# Altium project Mergen SMPS Board.PrjPcb
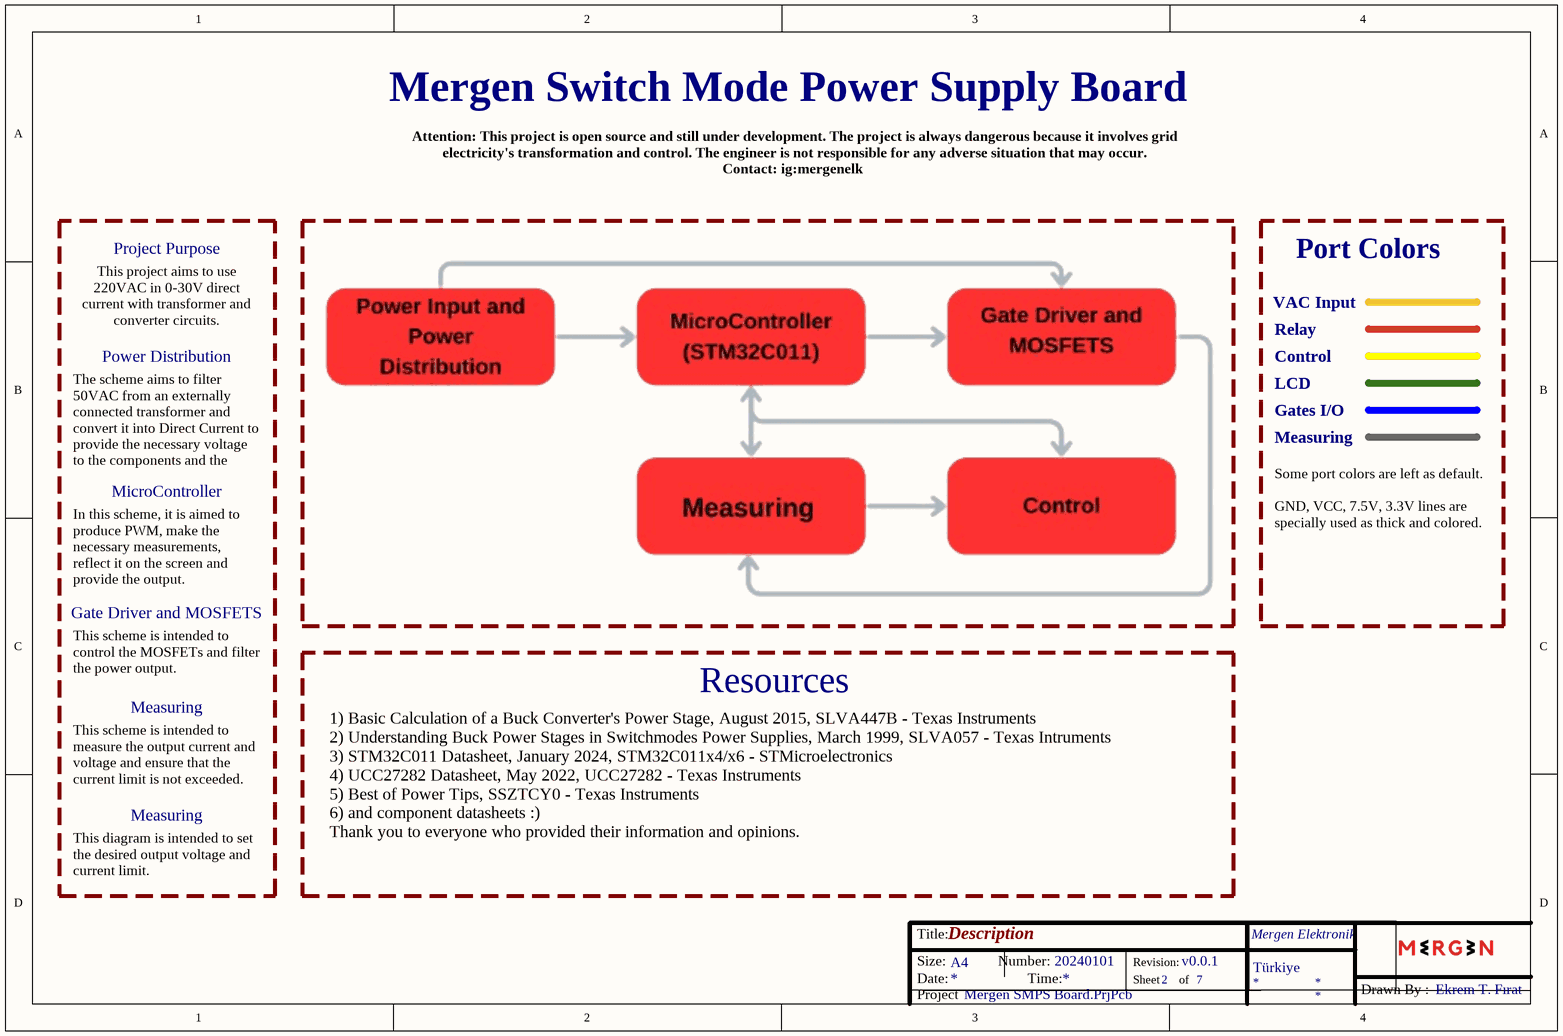
[diagram p0: Description.SchDoc]
6 sheets, 82 parts. Net scope: flat (ports and power ports of the same name join across sheets).
Sheets:
  Description.SchDoc
  PowerDistribution.SchDoc
  MicroController.SchDoc
  GateDriverandMosfets.SchDoc
  Measuring.SchDoc
  Control.SchDoc

## Sheet Description.SchDoc: Description
size A4; ApprovedBy: Ekrem Turan Fırat; CheckedBy: Ekrem Turan Fırat; Author: Ekrem Turan Fırat; CompanyName: Mergen Elektronik; DrawnBy: Ekrem T. Fırat; Engineer: Ekrem Turan Fırat; Organization: Mergen Elektronik; Address1: Türkiye; DocumentNumber: 20240101; Revision: v0.0.1; SheetNumber: 2; SheetTotal: 7

### Notes on the sheet
- Mergen Switch Mode Power Supply Board
- Attention: This project is open source and still under development. The project is always dangerous because it involves grid electricity's transformation and control. The engineer is not responsible for any adverse situation that may occur.
  Contact: ig:mergenelk
- Project Purpose
- Port Colors
- VAC Input
- This project aims to use 220VAC in 0-30V direct current with transformer and converter circuits.
- Power Distribution
- Relay
- Control
- LCD
- Gates I/O
- Measuring
- The scheme aims to filter 50VAC from an externally connected transformer and convert it into Direct Current to provide the necessary voltage to the components and the system.
- MicroController
- In this scheme, it is aimed to produce PWM, make the necessary measurements, reflect it on the screen and provide the output.
- Gate Driver and MOSFETS
- Some port colors are left as default.
  GND, VCC, 7.5V, 3.3V lines are specially used as thick and colored.
- This scheme is intended to control the MOSFETs and filter the power output.
- Resources
- This scheme is intended to measure the output current and voltage and ensure that the current limit is not exceeded.
- This diagram is intended to set the desired output voltage and current limit.
- 1) Basic Calculation of a Buck Converter's Power Stage, August 2015, SLVA447B - Texas Instruments
  2) Understanding Buck Power Stages in Switchmodes Power Supplies, March 1999, SLVA057 - Texas Intruments
  3) STM32C011 Datasheet, January 2024, STM32C011x4/x6 - STMicroelectronics
  4) UCC27282 Datasheet, May 2022, UCC27282 - Texas Instruments
  5) Best of Power Tips, SSZTCY0 - Texas Instruments
  6) and component datasheets :)
  Thank you to everyone who provided their information and opinions.
- Title:
- Size:
- Date:
- A4
- Number:
- Time:
- Revision:
- Sheet
- of
- Project
- Drawn By :

## Sheet PowerDistribution.SchDoc: Power Distribution
size A4; ApprovedBy: Ekrem Turan Fırat; CheckedBy: Ekrem Turan Fırat; Author: Ekrem Turan Fırat; CompanyName: Mergen Elektronik; DrawnBy: Ekrem T. Fırat; Engineer: Ekrem Turan Fırat; Organization: Mergen Elektronik; Address1: Türkiye; DocumentNumber: 20240101; Revision: v0.0.1; SheetNumber: 3; SheetTotal: 7
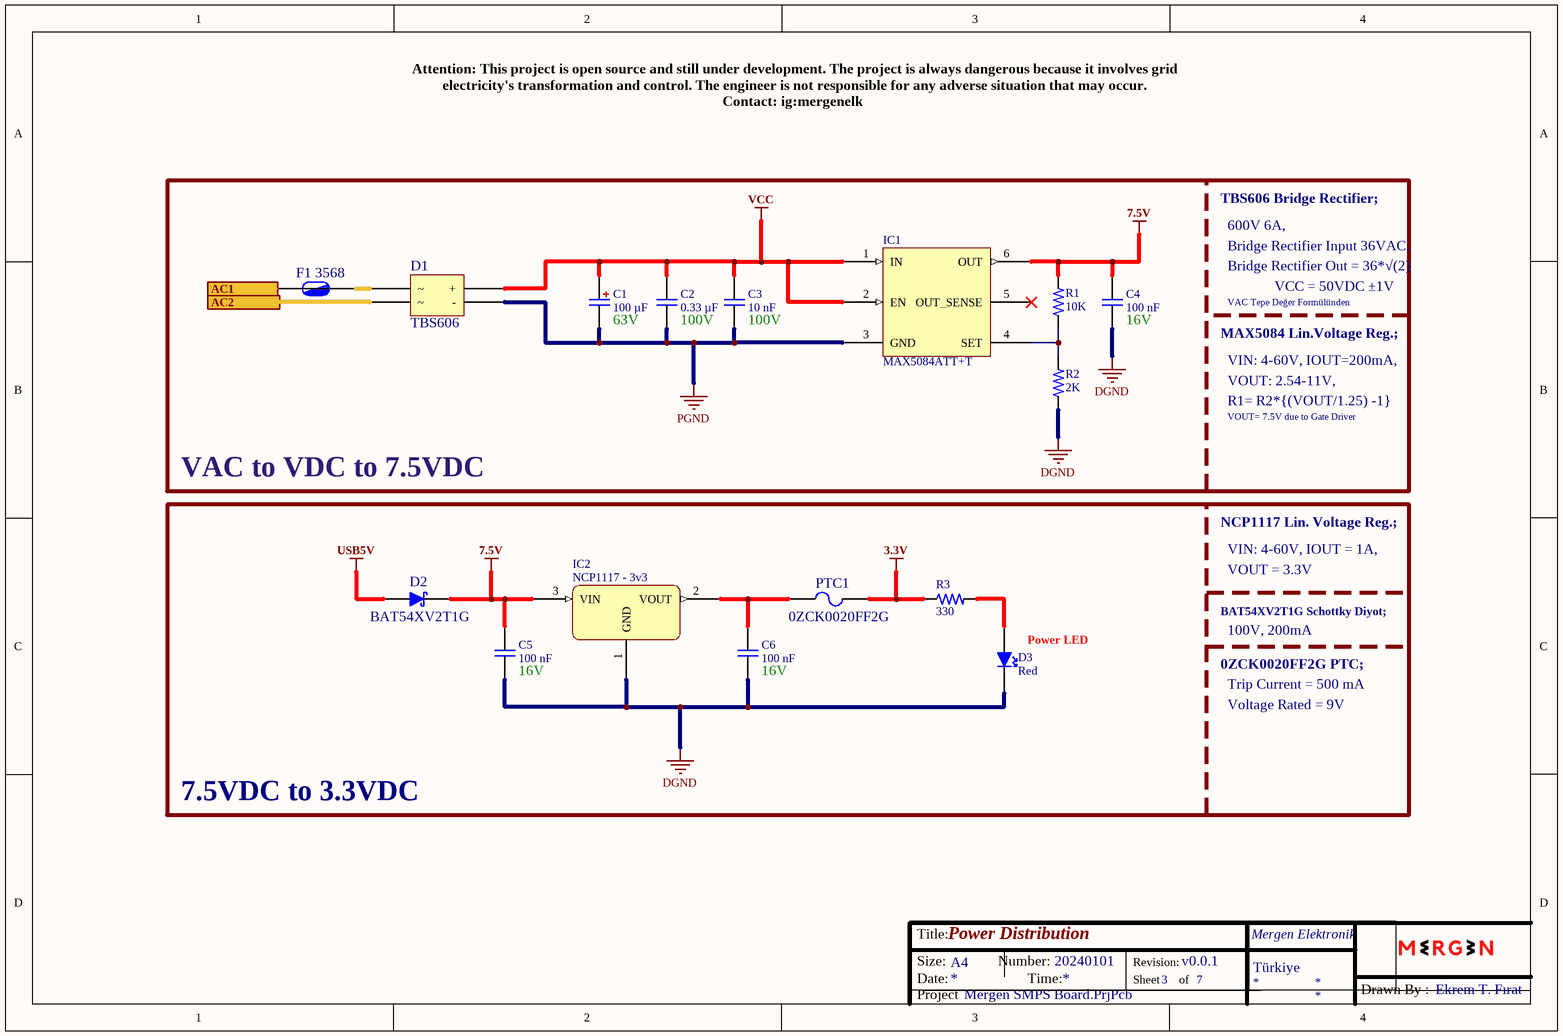
[diagram p1: PowerDistribution.SchDoc]

### Parts
C1  100 µF  Voltage Rated: 63V  [MergenElektronik_Capacitors_AluminumElectrolytics_SMDs_10x10.5mm]
C2  0.33 µF  Voltage Rated: 100V  [MergenElektronik_Capacitors_Ceramics_SMDs_1206_S_NS]
C3  10 nF  Voltage Rated: 100V  [MergenElektronik_Capacitors_Ceramics_SMDs_0603_S_NS]
C4  100 nF  Voltage Rated: 16V  [MergenElektronik_Capacitors_Ceramics_SMDs_0603_S_NS]
C5  100 nF  Voltage Rated: 16V  [MergenElektronik_Capacitors_Ceramics_SMDs_0603_S_NS]
C6  100 nF  Voltage Rated: 16V  [MergenElektronik_Capacitors_Ceramics_SMDs_0603_S_NS]
D1  TBS606  [MergenElektronik_Diodes_BridgeRectifiers_TBS606]
D2  BAT54XV2T1G  [MergenElektronik_Diodes_SchottkyDiodes_SOD-523]
D3  Red  [MergenElektronik_Leds_SMDs_0603_S_NS]
F1  3568  [MergenElektronik_FuseHolders_BladeType_3568]
IC1  MAX5084ATT+T  [MergenElektronik_Regulators_Linears_6-TDFN]
IC2  NCP1117 - 3v3  [MergenElektronik_Regulators_Linears_SOT223]
PTC1  0ZCK0020FF2G  [MergenElektronik_CircuitProtections_PTCs_0603_S_NS]
R1  10K  [MergenElektronik_Resistors_ChipResistors_0603_S_NS]
R2  2K  [MergenElektronik_Resistors_ChipResistors_0603_S_NS]
R3  330  [MergenElektronik_Resistors_ChipResistors_0603_S_NS]

### Blocks framed on the sheet
VAC to VDC to 7.5VDC: C1-C4 D1 F1 IC1 R1 R2
7.5VDC to 3.3VDC: C5 C6 D2 D3 IC2 PTC1 R3

### Ports
AC1 (in), AC2 (in)

### Nets
3.3V: PTC1.2 R3.1
7.5V: C4.1 C5.1 D2.2(KATOT) IC1.6(OUT) IC2.3(VIN) R1.2
DGND: C4.2 C5.2 C6.2 D3.2(KATOT) IC2.1(GND) R2.1
PGND: C1.1 C2.2 C3.2 D1.2(-) IC1.3(GND)
USB5V: D2.1(ANOT)
VCC: C1.2 C2.1 C3.1 D1.1(+) IC1.1(IN) IC1.2(EN)
NetC6_1: C6.1 IC2.2(VOUT) PTC1.1
NetD1_3: D1.3 F1.2
NetD1_4: D1.4 ; port AC2
NetD3_1: D3.1(ANOT) R3.2
NetIC1_4: IC1.4(SET) R1.1 R2.2

Not connected (* = marked no-connect by the designer): F1 1; IC1 5(OUT_SENSE)*

### Notes on the sheet
- Attention: This project is open source and still under development. The project is always dangerous because it involves grid electricity's transformation and control. The engineer is not responsible for any adverse situation that may occur.
  Contact: ig:mergenelk
- TBS606 Bridge Rectifier;
- 600V 6A,
- Bridge Rectifier Input 36VAC,
- Bridge Rectifier Out = 36*√(2)
- VAC Tepe Değer Formülünden
- VCC = 50VDC ±1V
- MAX5084 Lin.Voltage Reg.;
- VIN: 4-60V, IOUT=200mA,
- VOUT: 2.54-11V,
- R1= R2*{(VOUT/1.25) -1}
- VOUT= 7.5V due to Gate Driver
- NCP1117 Lin. Voltage Reg.;
- VIN: 4-60V, IOUT = 1A,
- VOUT = 3.3V
- (near D3) Power LED
- BAT54XV2T1G Schottky Diyot;
- 100V, 200mA
- 0ZCK0020FF2G PTC;
- Trip Current = 500 mA
- Voltage Rated = 9V
- Title:
- Size:
- Date:
- A4
- Number:
- Time:
- Revision:
- Sheet
- of
- Project
- Drawn By :

### Library data of the parts
C1 = MergenElektronik_Capacitors_AluminumElectrolytics_SMDs_UUX1J101MNL1GS: Mergen Elektronik - Capacitors - Aluminum Electrolytics - SMDs - UUX1J101MNL1GS; Manufacturer: Nichicon; Model: Aluminum Electrolytic Capacitors; Tolerance: ±20%; Value: 100 µF; Temperature: -55°C up to +105°C; Digi-Key Number: 493-7453-1-ND; Manufacturer Number: UUX1J101MNL1GS; Package: 10x10.5mm; Farnell Number: 2841944; Mouser Number: 647-UUX1J101MNL1GS; Mounting Type: Surface Mount; Supplier 1: Digikey; Supplier 2: Mouser; Supplier Part Number 1: 493-7453-1-ND; Supplier Part Number 2: 647-UUX1J101MNL1GS
C2 = MergenElektronik_Capacitors_Ceramic_SMDs_0.33µF_100V: Mergen Elektronik - Capacitors - Ceramics - SMDs - 1206 - 0.33 µF - 100V; Manufacturer: TDK Corporation; Manufacturer Number: C3216X7R2A334K130AA; Model: Ceramic Capacitors; Tolerance: ±10%; Value: 0.33 µF; Temperature: -55°C up to +125°C; Digi-Key Number: 445-4464-1-ND; Package: 1206(3216 Metric); Mouser Number: 810-C3216X7R2A334K; Mounting Type: Surface Mount; Farnell Number: 2525186; Supplier 1: Digikey; Supplier 2: Mouser; Supplier Part Number 1: 445-4464-6-ND; Supplier Part Number 2: 810-C3216X7R2A334K
C3 = MergenElektronik_Capacitors_Ceramic_SMDs_10nF_100V: Mergen Elektronik - Capacitors - Ceramics - SMDs - 0603 - 10 nF - 100V; Manufacturer: Murata Electronics; Manufacturer Number: GCM188R72A103KA37D; Model: Ceramic Capacitors; Tolerance: ±10%; Value: 10 nF; Temperature: -55°C up to +125°C; Digi-Key Number: 490-4781-1-ND; Package: 0603(1608 Metric); Mouser Number: 81-GCM188R72A103KA7D; Mounting Type: Surface Mount; Farnell Number: 2470432; Özdisan Number: GCM188R72A103KA37D; Supplier 1: Digikey; Supplier 2: Mouser; Supplier Part Number 1: 490-4781-1-ND; Supplier Part Number 2: 81-GCM188R72A103KA7D
C4-C6 = MergenElektronik_Capacitors_Ceramic_SMDs_100nF_16V: Mergen Elektronik - Capacitors - Ceramics - SMDs - 0603 - 100 nF - 16V; Manufacturer: Samsung; Manufacturer Number: CL10B104KO8NNNC; Model: Ceramic Capacitors; Tolerance: ±10%; Value: 100 nF; Temperature: -55°C up to +125°C; Digi-Key Number: 1276-1005-1-ND; Package: 0603(1608); Mouser Number: 187-CL10B104KO8NNNC; Mounting Type: Surface Mount; Farnell Number: 3013413; Supplier 1: Mouser; Supplier 2: Digi-Key; Supplier Part Number 1: 187-CL10B104KO8NNNC; Supplier Part Number 2: 1276-1005-6-ND; Özdisan Number: CL10B104KO8NNNC
D1 = MergenElektronik_Diodes_BridgeRectifiers_TBS606: Mergen Elektronik - Diodes - Bridge Rectifiers - TBS606; Manufacturer: Taiwan Semiconductor Corporation; Voltage Rated: 600V; Current Rating: 6A; Digi-Key Number: 1801-TBS606TR-ND; Model: Bridge Rectifier; Mounting Type: Surface Mount; Mouser Number: 821-TBS606; Package: TBS606; Temperature: -55°C up to 150°C (TJ); Value: TBS606; Supplier 1: Digikey; Supplier 2: Mouser; Supplier Part Number 1: 1801-TBS606CT-ND; Supplier Part Number 2: 821-TBS606; Manufacturer Number: TBS606
D2 = MergenElektronik_Diodes_SchottkyDiodes_BAT54XV2T1G: Mergen Elektronik - Diodes - Schottky Diodes - BAT54XV2T1G; Manufacturer: onsemi; Voltage Rated: 100V; Current Rating: 200mA; Value: VSSB7L45-M3/52T; Digi-Key Number: BAT54XV2T1GOSCT-ND; Manufacturer Number: BAT54XV2T1G; Model: Schottky Diodes; Mounting Type: Surface Mount; Package: SOD-523; Temperature: -55°C up to +150°C; Mouser Number: 863-BAT54XV2T1G; Farnell Number: 1459034; Supplier 1: Digikey; Supplier 2: Mouser; Supplier Part Number 1: BAT54XV2T1GOSCT-ND; Supplier Part Number 2: 863-SBAT54XV2T1G
D3 = MergenElektronik_LEDs_SMDs_Red_0603: Mergen Elektronik - Leds - SMDs - Red - 0603; Manufacturer: Würth Elektronik; Manufacturer Number: 150060RS75000; Voltage Rated: 2V; Model: SMD Leds; Value: Red; Temperature: -45°C up to +85°C; Digi-Key Number: 732-4978-1-ND; Package: 0603(1608); Farnell Number: 2322071; Mouser Number: 710-150060RS75000; Mounting Type: Surface Mount; Color: Red; Özdisan Number: 150060RS75000; Supplier 1: Digi-Key; Supplier 2: Mouser; Supplier Part Number 1: 732-4978-1-ND; Supplier Part Number 2: 710-150060RS75000
F1 = MergenElektronik_FuseHolders_BladeType_3568: Mergen Elektronik - Fuse Holder - Blade Type - 3568; Manufacturer: Keystone; Voltage Rated: 500V; Current Rating: 30A; Digi-Key Number: 36-3568-ND; Model: Blade Type; Mounting Type: THT; Mouser Number: 534-3568; Package: 3568; Temperature: -50°C up to+145°C; Value: 3568; Farnell Number: 2504685; Supplier 1: Digi-Key; Supplier 2: Mouser; Supplier Part Number 1: 36-3568-ND; Supplier Part Number 2: 534-3568; Manufacturer Number: 3568
IC1 = MergenElektronik_Regulators_Linears_MAX5084ATT+T: Mergen Elektronik - Regulators - Linears - MAX5084ATT+T; Manufacturer: Analog Devices Inc./Maxim Integrated; Current Rating: 200mA; Model: Linear; Output Voltage: 2.54V up to 11V; Voltage Rated: 4V up to 65V; Temperature: -40°C up to +125°C; Value: MAX5084ATT+T; Mounting Type: Surface Mount; Digi-Key Number: MAX5084ATT+TR-ND; Manufacturer Number: MAX5084ATT+T; Mouser Number: 700-MAX5084ATTT; Farnell Number: 2514348; Package: 6-TDFN; Supplier 1: Digikey; Supplier 2: Mouser; Supplier Part Number 1: MAX5084ATT+CT-ND; Supplier Part Number 2: 700-MAX5084ATTT
IC2 = MergenElektronik_Regulators_Linears_NCP1117ST33T3G: Mergen Elektronik - Regulators - Linears - NCP1117ST33T3G; Manufacturer: onsemi; Current Rating: 1A; Voltage Rated: 4.75VDC up to 10V; Model: Linear; Output Voltage: 3.3V; Temperature: 0°C up to +125°C; Value: NCP1117ST33T3G; Mounting Type: Surface Mount; Digi-Key Number: NCP1117ST33T3GOSCT-ND; Manufacturer Number: NCP1117ST33T3G; Mouser Number: 863-NCP1117ST33T3G; Özdisan Number: NCP1117ST33T3G; Supplier 1: Digi-Key; Supplier 2: Mouser; Supplier Part Number 1: NCP1117ST33T3GOSCT-ND; Supplier Part Number 2: 863-NCP1117ST33T3G; Package: SOT-223
PTC1 = MergenElektronik_CircuitProtections_PTCs_0ZCK0020FF2G: Mergen Elektronik - Circuit Protections - PTCs - 0ZCK0020FF2G; Manufacturer: Bel Fuse; Model: PTC Fuse; Voltage Rated: 9V; Current Rating: 500 mA; Current - Max: 100A; Current - Hold: 200 mA; Digi-Key Number: 507-1811-1-ND; Manufacturer Number: 0ZCK0020FF2G; Mounting Type: Surface Mount; Mouser Number: 530-0ZCK0020FF2G; Package: 0805(2012); Temperature: -40°C up to 85°C; Value: 0ZCK0020FF2G; Current - Trip: 500 mA; Supplier 1: Digi-Key; Supplier 2: Mouser; Supplier Part Number 1: 507-1811-6-ND; Supplier Part Number 2: 530-0ZCK0020FF2G
R1 = MergenElektronik_Resistors_ChipResistors_0603_10K: Mergen Elektronik - Resistors - Chip Resistors - 0603 - 10K; Manufacturer: Stackpole; Manufacturer Number: RMCF0603JT10K0; Value: Chip Resistor - 0603 - 10K; Power: 1/10W; Tolerance: ±5%; Package: 0603(1608); Temperature: -55°C up to +155°C - X8R; Model: Chip Resistor; Digi-Key Number: RMCF0603JT10K0CT-ND; Mounting Type: Surface Mount; Supplier 1: Digi-Key; Supplier Part Number 1: RMCF0603JT10K0-ND
R2 = MergenElektronik_Resistors_ChipResistors_0603_2K: Mergen Elektronik - Resistors - Chip Resistors - 0603 - 2K; Manufacturer: Panasonix; Manufacturer Number: ERJ-3EKF2001V; Value: Chip Resistor - 0603 - 2K; Power: 1/10W; Tolerance: ±1%; Package: 0603(1608); Temperature: -55°C up to +155°C - X8R; Model: Chip Resistor; Digi-Key Number: P2.00KHCT-ND; Mounting Type: Surface Mount; Mouser Number: 667-ERJ-3EKF2001V; Özdisan Number: ERJ-3EKF2001V; Farnell Number: 2059343; Supplier 1: Digikey; Supplier 2: Mouser; Supplier Part Number 1: P2.00KHDKR-ND; Supplier Part Number 2: 667-ERJ-3EKF2001V
R3 = MergenElektronik_Resistors_ChipResistors_0603_330R: Mergen Elektronik - Resistors - Chip Resistors - 0603 - 330R; Manufacturer: Stackpole; Manufacturer Number: RMCF0603JT330R; Value: Chip Resistor - 0603 - 330R; Power: 1/10W; Tolerance: ±5%; Package: 0603(1608); Temperature: -55°C up to +155°C - X8R; Model: Chip Resistor; Digi-Key Number: RMCF0603JT330RCT-ND; Mounting Type: Surface Mount; Supplier 1: Digi-Key; Supplier Part Number 1: RMCF0603JT330RCT-ND

## Sheet MicroController.SchDoc: MicroController
size A4; ApprovedBy: Ekrem Turan Fırat; CheckedBy: Ekrem Turan Fırat; Author: Ekrem Turan Fırat; CompanyName: Mergen Elektronik; DrawnBy: Ekrem T. Fırat; Engineer: Ekrem Turan Fırat; Organization: Mergen Elektronik; Address1: Türkiye; DocumentNumber: 20240101; Revision: v0.0.1; SheetNumber: 4; SheetTotal: 7
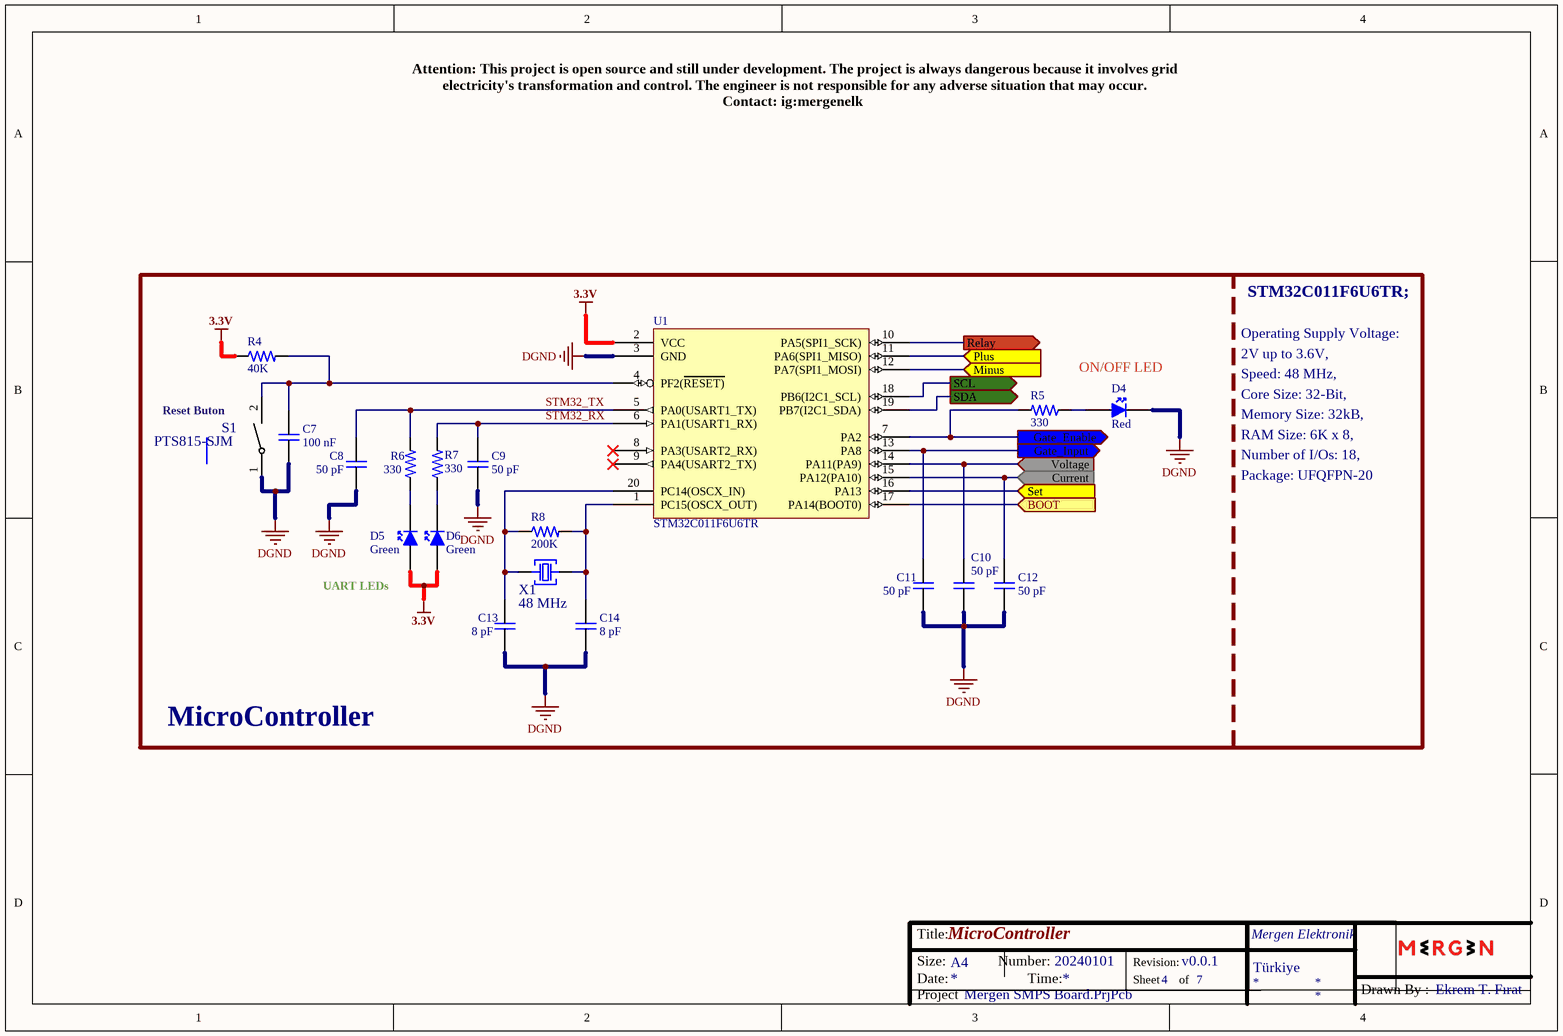
[diagram p2: MicroController.SchDoc]

### Parts
C7  100 nF  [MergenElektronik_Capacitors_Ceramics_SMDs_0603_S_NS]
C8  50 pF  [MergenElektronik_Capacitors_Ceramics_SMDs_0402_S_NS]
C9  50 pF  [MergenElektronik_Capacitors_Ceramics_SMDs_0402_S_NS]
C10  50 pF  [MergenElektronik_Capacitors_Ceramics_SMDs_0402_S_NS]
C11  50 pF  [MergenElektronik_Capacitors_Ceramics_SMDs_0402_S_NS]
C12  50 pF  [MergenElektronik_Capacitors_Ceramics_SMDs_0402_S_NS]
C13  8 pF  [MergenElektronik_Capacitors_Ceramics_SMDs_0603_S_NS]
C14  8 pF  [MergenElektronik_Capacitors_Ceramics_SMDs_0603_S_NS]
D4  Red  [MergenElektronik_Leds_SMDs_0603_S_NS]
D5  Green  [MergenElektronik_Leds_SMDs_0603_S_NS]
D6  Green  [MergenElektronik_Leds_SMDs_0603_S_NS]
R4  40K  [MergenElektronik_Resistors_ChipResistors_0603_S_NS]
R5  330  [MergenElektronik_Resistors_ChipResistors_0603_S_NS]
R6  330  [MergenElektronik_Resistors_ChipResistors_0603_S_NS]
R7  330  [MergenElektronik_Resistors_ChipResistors_0603_S_NS]
R8  200K  [MergenElektronik_Resistors_ChipResistors_0603_S_NS]
S1  PTS815-SJM  [MergenElektronik_Switches_TactileSwitches_PTS815]
U1  STM32C011F6U6TR  [MergenElektronik_Microcontrollers_STMicroelectronics_UFQFPN-20]
X1  48 MHz  [MergenElektronik_Oscillators_Crystals_2-SMD]

### Ports
BOOT (in), Current (in, see Measuring[4B]), Gate_Enable (out, see GateDriverandMosfets[1B]), Gate_Input (out, see GateDriverandMosfets[1C]), Minus (in, see Control[2C]), Plus (in, see Control[2C]), Relay (out, see Measuring[1C]), SCL (out, see Control[2B]), SDA (out, see Control[2B]), Set (in, see Control[3C]), Voltage (in, see Measuring[2C])

### Nets
3.3V: D5.1(ANOT) D6.1(ANOT) R4.1 U1.2(VCC)
DGND: C7.2 C8.2 C9.2 C10.2 C11.2 C12.2 C13.2 C14.2 D4.2(KATOT) S1.1 U1.3(GND)
STM32_RX: C9.1 R7.2 U1.6(PA1(USART1_RX))
STM32_TX: C8.1 R6.2 U1.5(PA0(USART1_TX))
NetC7_1: C7.1 R4.2 S1.2 U1.4(PF2(RESET))
NetC10_1: C10.1 U1.14(PA11(PA9)) ; port Voltage
NetC11_1: C11.1 U1.13(PA8) ; port Gate_Input
NetC12_1: C12.1 U1.15(PA12(PA10)) ; port Current
NetC13_1: C13.1 R8.1 U1.20(PC14(OSCX_IN)) X1.1
NetC14_1: C14.1 R8.2 U1.1(PC15(OSCX_OUT)) X1.2
NetC18_1: R5.2 U1.7(PA2) ; port Gate_Enable
NetC22_2: U1.11(PA6(SPI1_MISO)) ; port Plus
NetC23_2: U1.12(PA7(SPI1_MOSI)) ; port Minus
NetC24_2: U1.16(PA13) ; port Set
NetD4_1: D4.1(ANOT) R5.1
NetD5_2: D5.2(KATOT) R6.1
NetD6_2: D6.2(KATOT) R7.1
NetJ1_1: U1.18(PB6(I2C1_SCL)) ; port SCL
NetJ1_2: U1.19(PB7(I2C1_SDA)) ; port SDA
NetR22_1: U1.10(PA5(SPI1_SCK)) ; port Relay
NetU1_17: U1.17(PA14(BOOT0)) ; port BOOT

Not connected (* = marked no-connect by the designer): U1 8(PA3(USART2_RX))* 9(PA4(USART2_TX))*

### Notes on the sheet
- Attention: This project is open source and still under development. The project is always dangerous because it involves grid electricity's transformation and control. The engineer is not responsible for any adverse situation that may occur.
  Contact: ig:mergenelk
- STM32C011F6U6TR;
- ON/OFF LED
- Operating Supply Voltage:
- 2V up to 3.6V,
- Speed: 48 MHz,
- Reset Buton
- Core Size: 32-Bit,
- Memory Size: 32kB,
- RAM Size: 6K x 8,
- Number of I/Os: 18,
- Package: UFQFPN-20
- UART LEDs
- MicroController
- Title:
- Size:
- Date:
- A4
- Number:
- Time:
- Revision:
- Sheet
- of
- Project
- Drawn By :

### Library data of the parts
C7 = MergenElektronik_Capacitors_Ceramic_SMDs_100nF_16V: as C4 on sheet PowerDistribution; Value: 100 nF; Temperature: -55°C up to +125°C; Digi-Key Number: 1276-1005-1-ND; Package: 0603(1608); Mouser Number: 187-CL10B104KO8NNNC; Mounting Type: Surface Mount; Farnell Number: 3013413; Supplier 1: Mouser; Supplier 2: Digi-Key; Supplier Part Number 1: 187-CL10B104KO8NNNC; Supplier Part Number 2: 1276-1005-6-ND; Özdisan Number: CL10B104KO8NNNC; Voltage Rated: 16V
C8-C12 = MergenElektronik_Capacitors_Ceramic_SMDs_50pF_50V: Mergen Elektronik - Capacitors - Ceramics - SMDs - 0603 - 50 pF - 50V; Manufacturer: YAGEO; Manufacturer Number: CC0402JRNPO9BN500; Model: Ceramic Capacitors; Tolerance: ±5%; Value: 50 pF; Temperature: -55°C up to +125°C; Digi-Key Number: 13-CC0402JRNPO9BN500TR-ND; Package: 0603(1608); Mouser Number: 603-CC0402JNPO9BN500; Mounting Type: Surface Mount; Supplier 1: Digi-Key; Supplier 2: Mouser; Supplier Part Number 1: 13-CC0402JRNPO9BN500TR-ND; Supplier Part Number 2: 603-CC0402JNPO9BN500; Özdisan Number: CC0402JRNPO9BN500; Voltage Rated: 50V
C13 C14 = MergenElektronik_Capacitors_Ceramic_SMDs_8pF_50V: Mergen Elektronik - Capacitors - Ceramics - SMDs - 0603 - 8 pF - 50V; Manufacturer: YAGEO; Manufacturer Number: CC0603DRNPO9BN8R0; Model: Ceramic Capacitors; Tolerance: ±0.5pF; Value: 8 pF; Temperature: -55°C up to +125°C; Digi-Key Number: 311-1057-1-ND; Package: 0603(1608); Mouser Number: 603-CC603DRNPO9BN8R0; Mounting Type: Surface Mount; Özdisan Number: CC0603DRNPO9BN8R0; Farnell Number: 3764404RL; Supplier 1: Digikey; Supplier 2: Mouser; Supplier Part Number 1: 311-1057-6-ND; Supplier Part Number 2: 603-CC603DRNPO9BN8R0; Voltage Rated: 50V
D4 = MergenElektronik_LEDs_SMDs_Red_0603: as D3 on sheet PowerDistribution; Value: Red; Temperature: -45°C up to +85°C; Digi-Key Number: 732-4978-1-ND; Package: 0603(1608); Farnell Number: 2322071; Mouser Number: 710-150060RS75000; Mounting Type: Surface Mount; Color: Red; Özdisan Number: 150060RS75000; Supplier 1: Digi-Key; Supplier 2: Mouser; Supplier Part Number 1: 732-4978-1-ND; Supplier Part Number 2: 710-150060RS75000
D5 D6 = MergenElektronik_LEDs_SMDs_Green_0603: Mergen Elektronik - Leds - SMDs - Green - 0603; Manufacturer: Würth Elektronik; Manufacturer Number: 150060GS75000; Voltage Rated: 3.2V; Model: SMD Leds; Value: Green; Temperature: -45°C up to +85°C; Digi-Key Number: 732-4971-1-ND; Package: 0603(1608); Farnell Number: 2322070; Mouser Number: 710-150060GS75000; Mounting Type: Surface Mount; Color: Green; Özdisan Number: 150060GS75000; Supplier 1: Digi-Key; Supplier 2: Mouser; Supplier Part Number 1: 732-4971-6-ND; Supplier Part Number 2: 710-150060GS75000
R4 = MergenElektronik_Resistors_ChipResistors_0603_40K: Mergen Elektronik - Resistors - Chip Resistors - 0603 - 40K; Manufacturer: YAGEO; Manufacturer Number: RT0603BRD0740KL; Value: Chip Resistor - 0603 - 40K; Power: 1/10W; Tolerance: ±0.1%; Package: 0603(1608); Temperature: -55°C up to +155°C - X8R; Model: Chip Resistor; Digi-Key Number: 13-RT0603BRD0740KLTR-ND; Mounting Type: Surface Mount; Mouser Number: 603-RT0603BRD0740KL; Supplier 1: Digikey; Supplier 2: Mouser; Supplier Part Number 1: 13-RT0603BRD0740KLDKR-ND; Supplier Part Number 2: 603-RT0603BRD0740KL
R5-R7 = MergenElektronik_Resistors_ChipResistors_0603_330R: as R3 on sheet PowerDistribution; Package: 0603(1608); Temperature: -55°C up to +155°C - X8R; Model: Chip Resistor; Digi-Key Number: RMCF0603JT330RCT-ND; Mounting Type: Surface Mount; Supplier 1: Digi-Key; Supplier Part Number 1: RMCF0603JT330RCT-ND
R8 = MergenElektronik_Resistors_ChipResistors_0603_200K: Mergen Elektronik - Resistors - Chip Resistors - 0603 - 200K; Manufacturer: Stackpole; Manufacturer Number: RMCF0603FT200K; Value: Chip Resistor - 0603 - 200K; Power: 1/10W; Tolerance: ±1%; Package: 0603(1608); Temperature: -55°C up to +155°C - X8R; Model: Chip Resistor; Digi-Key Number: RMCF0603FT200KTR-ND; Mounting Type: Surface Mount; Mouser Number: 708-RMCF0603FT200K; Supplier 1: Digikey; Supplier 2: Mouser; Supplier Part Number 1: RMCF0603FT200KTR-ND; Supplier Part Number 2: 708-RMCF0603FT200K
S1 = MergenElektronik_Switches_TactileSwitches_PTS815-SJM: Mergen Elektronik - Switches - Tactile  Switches; Manufacturer Number: PTS815 SJM 250 SMTR LFS; Manufacturer: C&K; Current Rating: 50mA; Voltage Rated: 12VDC; Digi-Key Number: CKN12215-1-ND; Model: Tactile Switches; Mounting Type: Surface Mount; Package: PTS815; Temperature: -20°C up to +70°C; Value: PTS815-SJM; Mouser Number: 611-PTS815SJM250SMTR; Farnell Number: 3780619; Supplier 1: Mouser; Supplier 2: Digi-Key; Supplier Part Number 1: 611-PTS815SJM250SMTR; Supplier Part Number 2: CKN12215-6-ND
U1 = MergenElektronik_Microcontrollers_STMicroelectronics_STM32C011F6U6TR: Mergen Elektronik - Microcontrollers - STMicroelectronics - STM32C011F6U6TR; Model: ARM® Cortex®-M0+ Microcontroller; Operating Supply Voltage: 2V up to 3.6V; Number of I/O: 18; Speed: 48MHz; Core Size: 32-Bit; Memory Size: 32kB; Ram Size: 6K x 8; Digi-Key Number: 497-STM32C011F6U6TR-ND; Manufacturer: STMicroelectronics; Manufacturer Number: STM32C011F6U6TR; Mounting Type: Surface Mount; Mouser Number: 511-STM32C011F6U6TR; Package: UFQFPN-20; Temperature: -40°C up to 85°C (TA); Value: STM32C011F6U6TR; Farnell Number: 4138292RL; Supplier 1: Digikey; Supplier 2: Mouser; Supplier Part Number 1: 497-STM32C011F6U6TRCT-ND; Supplier Part Number 2: 511-STM32C011F6U6TR
X1 = MergenElektronik_Oscillators_Crystals_2_SMD_48MHz: Mergen Elektronik - Oscilators - Crystals - 2-SMD - 48 MHz; Manufacturer: NDK America, Inc.; Manufacturer Number: LNCD1-48M; Model: Crystal Oscilator; Value: 12 MHz; Load Capacitance: 8 pF; Digi-Key Number: 644-LNCD1-48MTR-ND; Mounting Type: Surface Mount; Frequency: 48 MHz; Package: 2-SMD; Temperature: -40°C up to 85°C; Supplier 1: Digi-Key; Supplier Part Number 1: 644-LNCD1-48MTR-ND

## Sheet GateDriverandMosfets.SchDoc: Gate Driver and MOSFETs
size A4; ApprovedBy: Ekrem Turan Fırat; CheckedBy: Ekrem Turan Fırat; Author: Ekrem Turan Fırat; CompanyName: Mergen Elektronik; DrawnBy: Ekrem T. Fırat; Engineer: Ekrem Turan Fırat; Organization: Mergen Elektronik; Address1: Türkiye; DocumentNumber: 20240101; Revision: v0.0.1; SheetNumber: 5; SheetTotal: 7
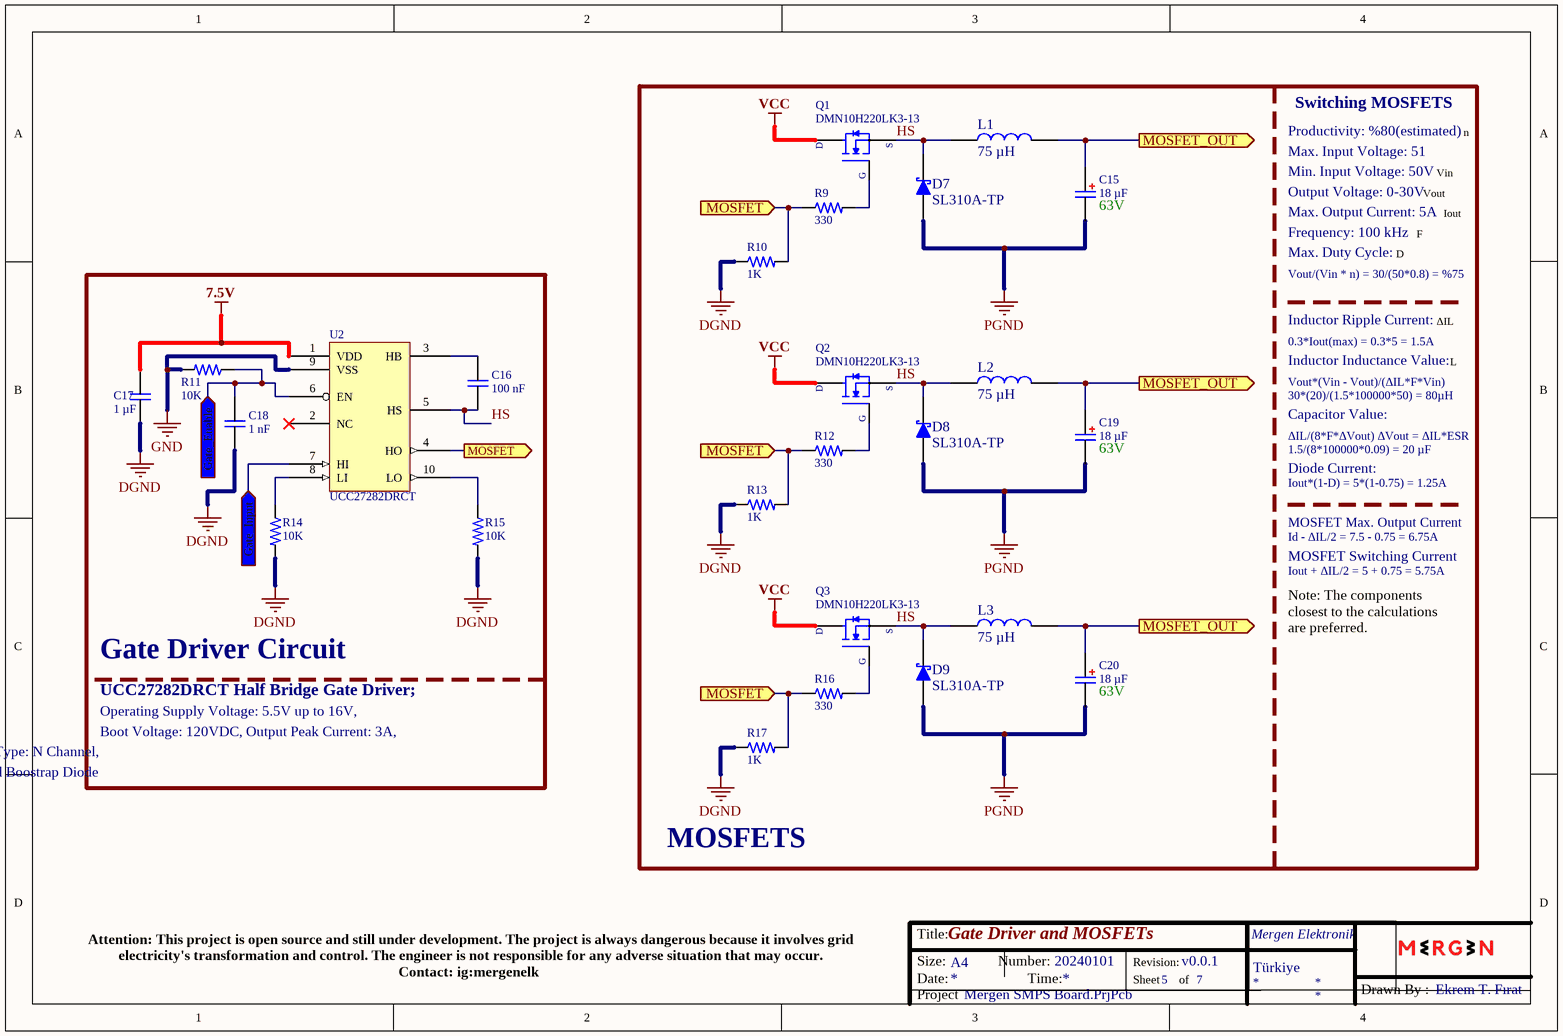
[diagram p3: GateDriverandMosfets.SchDoc]

### Parts
C15  18 µF  Voltage Rated: 63V  [MergenElektronik_Capacitors_AluminumElectrolytics_THTs_8x7MM]
C16  100 nF  [MergenElektronik_Capacitors_Ceramics_SMDs_0603_S_NS]
C17  1 µF  [MergenElektronik_Capacitors_Ceramics_SMDs_1206_S_NS]
C18  1 nF  [MergenElektronik_Capacitors_Ceramics_SMDs_0402_S_NS]
C19  18 µF  Voltage Rated: 63V  [MergenElektronik_Capacitors_AluminumElectrolytics_THTs_8x7MM]
C20  18 µF  Voltage Rated: 63V  [MergenElektronik_Capacitors_AluminumElectrolytics_THTs_8x7MM]
D7  SL310A-TP  [MergenElektronik_Diodes_SchottkyDiodes_DO-214AC (SMA)]
D8  SL310A-TP  [MergenElektronik_Diodes_SchottkyDiodes_DO-214AC (SMA)]
D9  SL310A-TP  [MergenElektronik_Diodes_SchottkyDiodes_DO-214AC (SMA)]
L1  75 µH  [MergenElektronik_Inductors_PowerInductors_SMDs_8x8x4mm_Shielded]
L2  75 µH  [MergenElektronik_Inductors_PowerInductors_SMDs_8x8x4mm_Shielded]
L3  75 µH  [MergenElektronik_Inductors_PowerInductors_SMDs_8x8x4mm_Shielded]
Q1  DMN10H220LK3-13  [MergenElektronik_Transistors_Mosfets_TO-252-3(DPAK)]
Q2  DMN10H220LK3-13  [MergenElektronik_Transistors_Mosfets_TO-252-3(DPAK)]
Q3  DMN10H220LK3-13  [MergenElektronik_Transistors_Mosfets_TO-252-3(DPAK)]
R9  330  [MergenElektronik_Resistors_ChipResistors_0603_S_NS]
R10  1K  [MergenElektronik_Resistors_ChipResistors_0603_S_NS]
R11  10K  [MergenElektronik_Resistors_ChipResistors_0603_S_NS]
R12  330  [MergenElektronik_Resistors_ChipResistors_0603_S_NS]
R13  1K  [MergenElektronik_Resistors_ChipResistors_0603_S_NS]
R14  10K  [MergenElektronik_Resistors_ChipResistors_0603_S_NS]
R15  10K  [MergenElektronik_Resistors_ChipResistors_0603_S_NS]
R16  330  [MergenElektronik_Resistors_ChipResistors_0603_S_NS]
R17  1K  [MergenElektronik_Resistors_ChipResistors_0603_S_NS]
U2  UCC27282DRCT  [MergenElektronik_Logics_GateDrivers_10VSON]

### Blocks framed on the sheet
MOSFETS: C15 C19 C20 D7-D9 L1-L3 Q1-Q3 R9 R10 R12 R13 R16 R17
Gate Driver Circuit: C16-C18 R11 R14 R15 U2

### Ports
Gate_Enable (in, see MicroController[3B]), Gate_Input (in, see MicroController[3B]), MOSFET (in, see GateDriverandMosfets[2A], GateDriverandMosfets[2B]), MOSFET (in, see GateDriverandMosfets[2A], GateDriverandMosfets[2B], GateDriverandMosfets[2C]), MOSFET (in, see GateDriverandMosfets[2B], GateDriverandMosfets[2C]), MOSFET (out, see GateDriverandMosfets[2A], GateDriverandMosfets[2B], GateDriverandMosfets[2C]), MOSFET_OUT (out, see GateDriverandMosfets[3A], GateDriverandMosfets[3B], Measuring[2C]), MOSFET_OUT (out, see GateDriverandMosfets[3A], GateDriverandMosfets[3C], Measuring[2C]), MOSFET_OUT (out, see GateDriverandMosfets[3B], GateDriverandMosfets[3C], Measuring[2C])

### Nets
7.5V: C17.1 U2.1(VDD)
DGND: C17.2 C18.2 R10.1 R13.1 R14.2 R15.2 R17.1
GND: R11.2 U2.9(VSS)
PGND: C15.KATOT C19.KATOT C20.KATOT D7.1(ANOT) D8.1(ANOT) D9.1(ANOT)
VCC: Q1.3(Drain) Q2.3(Drain) Q3.3(Drain)
HS: C16.2 D7.2(KATOT) D8.2(KATOT) D9.2(KATOT) L1.1 L2.1 L3.1 Q1.2(Source) Q2.2(Source) Q3.2(Source) U2.5(HS)
NetC11_1: U2.7(HI) ; port Gate_Input
NetC15_ANOT: C15.ANOT C19.ANOT C20.ANOT L1.2 L2.2 L3.2 ; port MOSFET_OUT
NetC16_1: C16.1 U2.3(HB)
NetC18_1: C18.1 R11.1 U2.6(EN) ; port Gate_Enable
NetQ1_1: Q1.1(Gate) R9.2
NetQ2_1: Q2.1(Gate) R12.2
NetQ3_1: Q3.1(Gate) R16.2
NetR9_1: R9.1 R10.2 R12.1 R13.2 R16.1 R17.2 U2.4(HO) ; port MOSFET
NetR14_1: R14.1 U2.8(LI)
NetR15_1: R15.1 U2.10(LO)

Not connected (* = marked no-connect by the designer): U2 2(NC)*

### Notes on the sheet
- Switching MOSFETS
- Productivity: %80(estimated)
- Max. Input Voltage: 51
- Min. Input Voltage: 50V
- Vin
- n
- Output Voltage: 0-30V
- Max. Output Current: 5A
- Frequency: 100 kHz
- F
- Vout
- Iout
- Max. Duty Cycle:
- Vout/(Vin * n) = 30/(50*0.8) = %75
- D
- Inductor Ripple Current:
- 0.3*Iout(max) = 0.3*5 = 1.5A
- Inductor Inductance Value:
- Vout*(Vin - Vout)/(ΔIL*F*Vin)
- ΔIL
- L
- 30*(20)/(1.5*100000*50) = 80µH
- Capacitor Value:
- ΔIL/(8*F*ΔVout) ΔVout = ΔIL*ESR
- 1.5/(8*100000*0.09) = 20 µF
- Diode Current:
- Iout*(1-D) = 5*(1-0.75) = 1.25A
- MOSFET Max. Output Current
- Id - ΔIL/2 = 7.5 - 0.75 = 6.75A
- MOSFET Switching Current
- Iout + ΔIL/2 = 5 + 0.75 = 5.75A
- Note: The components closest to the calculations are preferred.
- UCC27282DRCT Half Bridge Gate Driver;
- Operating Supply Voltage: 5.5V up to 16V,
- Boot Voltage: 120VDC, Output Peak Current: 3A,
- Integreted Boostrap Diode
- Gate Type: N Channel,
- Attention: This project is open source and still under development. The project is always dangerous because it involves grid electricity's transformation and control. The engineer is not responsible for any adverse situation that may occur.
  Contact: ig:mergenelk
- Title:
- Size:
- Date:
- A4
- Number:
- Time:
- Revision:
- Sheet
- of
- Project
- Drawn By :
- (in symbol MergenElektronik_Transistors_Mosfets_DMN10H220LK3-13) D; S; G

### Library data of the parts
C15 C19 C20 = MergenElektronik_Capacitors_AluminumElectrolytics_SMDs_63SXE18M: Mergen Elektronik- Capacitors - Aluminum Electrolytics - THTs - 63SXE18M; Manufacturer: Panasonic; Manufacturer Number: 100SXE6R8M; Model: Aluminum Electrolytic Capacitors; Tolerance: ±20%; Value: 18 µF; Temperature: -55°C up to +125°C; Digi-Key Number: P122614-ND; Package: 8x7mm; Farnell Number: 2920530; Mouser Number: 667-63SXE18M; Mounting Type: Through Hole; Supplier 1: Digikey; Supplier 2: Mouser; Supplier Part Number 1: P122614-ND; Supplier Part Number 2: 667-63SXE18M; Özdisan Number: 63SXE18M
C16 = MergenElektronik_Capacitors_Ceramic_SMDs_100nF_100V: Mergen Elektronik - Capacitors - Ceramics - SMDs - 0603 - 100 nF - 100V; Manufacturer: Samsung; Manufacturer Number: CL10B104KC8NNNC; Model: Ceramic Capacitors; Tolerance: ±10%; Value: 100 nF; Temperature: -55°C up to +125°C; Digi-Key Number: 1276-6807-1-ND; Package: 0603(1608 Metric); Mouser Number: 187-CL10B104KC8NNNC; Mounting Type: Surface Mount; Farnell Number: 3013412; Özdisan Number: CL10B104KC8NNNC; Supplier 1: Digikey; Supplier 2: Mouser; Supplier Part Number 1: 1276-6807-1-ND; Supplier Part Number 2: 187-CL10B104KC8NNNC; Voltage Rated: 100V
C17 = MergenElektronik_Capacitors_Ceramic_SMDs_1µF_100V: Mergen Elektronik - Capacitors - Ceramics - SMDs - 1206 - 1 µF - 100V; Manufacturer: Samsung; Manufacturer Number: CL31B105KCHNNNE; Model: Ceramic Capacitors; Tolerance: ±10%; Value: 1 µF; Temperature: -55°C up to +125°C; Digi-Key Number: 1276-1838-1-ND; Package: 1206(3216 Metric); Mouser Number: 187-CL31B105KCHNNNE; Mounting Type: Surface Mount; Özdisan Number: CL31B105KCHNNNE; Supplier 1: Digikey; Supplier 2: Mouser; Supplier Part Number 1: 1276-1838-1-ND; Supplier Part Number 2: 187-CL31B105KCHNNNE; Voltage Rated: 100V
C18 = MergenElektronik_Capacitors_Ceramic_SMDs_1nF_50V: Mergen Elektronik - Capacitors - Ceramics - SMDs - 0402 - 1 nF - 50V; Manufacturer: Murata Electronics; Manufacturer Number: GRM1555C1H102JA01D; Model: Ceramic Capacitors; Tolerance: ±5%; Value: 1 nF; Temperature: -55°C up to +125°C; Digi-Key Number: 490-3244-1-ND; Package: 0402(1005 Metric); Mouser Number: 81-GRM1555C1H102JA1D; Mounting Type: Surface Mount; Farnell Number: 8819556; Özdisan Number: GRM1555C1H102JA01D; Supplier 1: Digikey; Supplier 2: Mouser; Voltage Rated: 50V; Supplier Part Number 1: 490-3244-1-ND; Supplier Part Number 2: 81-GRM1555C1H102JA1D
D7-D9 = MergenElektronik_Diodes_SchottkyDiodes_SL310A-TP: Mergen Elektronik - Diodes - Schottky Diodes - SL310A-TP; Manufacturer: Micro Commercial Co; Voltage Rated: 100V; Current Rating: 3A; Value: VSSB7L45-M3/52T; Digi-Key Number: SL310A-TPMSTR-ND; Manufacturer Number: SL310A-TP; Model: Schottky Diodes; Mounting Type: Surface Mount; Package: DO-214AC(SMA); Temperature: -55°C up to +150°C; Supplier 1: Digikey; Supplier 2: Mouser; Supplier Part Number 1: SL310A-TPMSDKR-ND; Supplier Part Number 2: 833-SL310A-TP; Mouser Number: 833-SL310A-TP
L1-L3 = MergenElektronik_Inductors_PowerInductors_SMDs_ASPI-8040S-750M-T: Mergen Elektronik - Inductors - Power Inductors - SMDs - 8x8mm  75-µh - 1.2A; Manufacturer: Abracon LLC; Digi-Key Number: 535-13053-1-ND; Manufacturer Number: ASPI-8040S-750M-T; Model: Power Inductor; Mounting Type: Surface Mount; Package: 8x8x4mm Shielded; Temperature: -40°C up to  125°C; Value: 75 µH; Current Rating: 1.2A; Mouser Number: 815-ASPI-8040S-750MT; Supplier 1: Digikey; Supplier 2: Mouser; Supplier Part Number 1: 535-13053-1-ND; Supplier Part Number 2: 815-ASPI-8040S-750MT
Q1-Q3 = MergenElektronik_Transistors_Mosfets_DMN10H220LK3-13: Mergen Elektronik - Transistors - Mosfets - DMN10H220LK3-13; Manufacturer: Diodes Incorporated; Voltage Rated: 100V; Model: Mosfet; Id: 7.5A; Value: DMN10H220LK3-13; Temperature: -55°C up to +175°C (TJ); Digi-Key Number: 31-DMN10H220LK3-13CT-ND; Manufacturer Number: DMN10H220LK3-13; Package: TO-252-3 DPAK; Mounting Type: Surface Mount; Vdss: 100V; Rating Current: 7.5A; Mouser Number: 621-DMN10H220LK3-13; Farnell Number: 3943521RL; Current Rating: 7.5A; Supplier 1: Digikey; Supplier 2: Mouser; Supplier Part Number 1: 31-DMN10H220LK3-13CT-ND; Supplier Part Number 2: 621-DMN10H220LK3-13
R9 R12 R16 = MergenElektronik_Resistors_ChipResistors_0603_330R: as R3 on sheet PowerDistribution; Package: 0603(1608); Temperature: -55°C up to +155°C - X8R; Model: Chip Resistor; Digi-Key Number: RMCF0603JT330RCT-ND; Mounting Type: Surface Mount; Supplier 1: Digi-Key; Supplier Part Number 1: RMCF0603JT330RCT-ND
R10 R13 R17 = MergenElektronik_Resistors_ChipResistors_0603_1K: Mergen Elektronik - Resistors - Chip Resistors - 0603 - 1K; Manufacturer: Stackpole; Manufacturer Number: RMCF0603JT1K00; Value: Chip Resistor - 0603 - 1K; Power: 1/10W; Tolerance: ±5%; Package: 0603(1608); Temperature: -55°C up to +155°C - X8R; Model: Chip Resistor; Digi-Key Number: RMCF0603JT1K00CT-ND; Mounting Type: Surface Mount; Mouser Number: 708-RMCF0603JT1K00; Supplier 1: Digikey; Supplier 2: Mouser; Supplier Part Number 1: RMCF0603JT1K00DKR-ND; Supplier Part Number 2: 708-RMCF0603JT1K00
R11 R14 R15 = MergenElektronik_Resistors_ChipResistors_0603_10K: as R1 on sheet PowerDistribution; Package: 0603(1608); Temperature: -55°C up to +155°C - X8R; Model: Chip Resistor; Digi-Key Number: RMCF0603JT10K0CT-ND; Mounting Type: Surface Mount; Supplier 1: Digi-Key; Supplier Part Number 1: RMCF0603JT10K0-ND
U2 = MergenElektronik_Logics_GateDrivers_UCC27282DRCT: Mergen Elektronik - Logics - Gate Drivers - UCC27282DRCT; Manufacturer: Texas Instruments; Operating Supply Voltage: 5.5V up to 16VDC; Voltage Rated: 120VDC; Current Rating: 3A; Gate Driver Type: Half Bridge; Channel Type: İndependent; Gaye Type: N-Channel MOSFET; Digi-Key Number: 296-53422-1-ND; Manufacturer Number: UCC27282DRCT; Model: Gate Driver; Mounting Type: Surface Mount; Mouser Number: 595-UCC27282DRCT; Package: 10-VSON 3x3; Temperature: -40°C up to 125°C; Value: UCC27282DRCT; Supplier 1: Digikey; Supplier 2: Mouser; Supplier Part Number 1: 296-53422-1-ND; Supplier Part Number 2: 595-UCC27282DRCT

## Sheet Measuring.SchDoc: Measuring
size A4; ApprovedBy: Ekrem Turan Fırat; CheckedBy: Ekrem Turan Fırat; Author: Ekrem Turan Fırat; CompanyName: Mergen Elektronik; DrawnBy: Ekrem T. Fırat; Engineer: Ekrem Turan Fırat; Organization: Mergen Elektronik; Address1: Türkiye; DocumentNumber: 20240101; Revision: v0.0.1; SheetNumber: 6; SheetTotal: 7
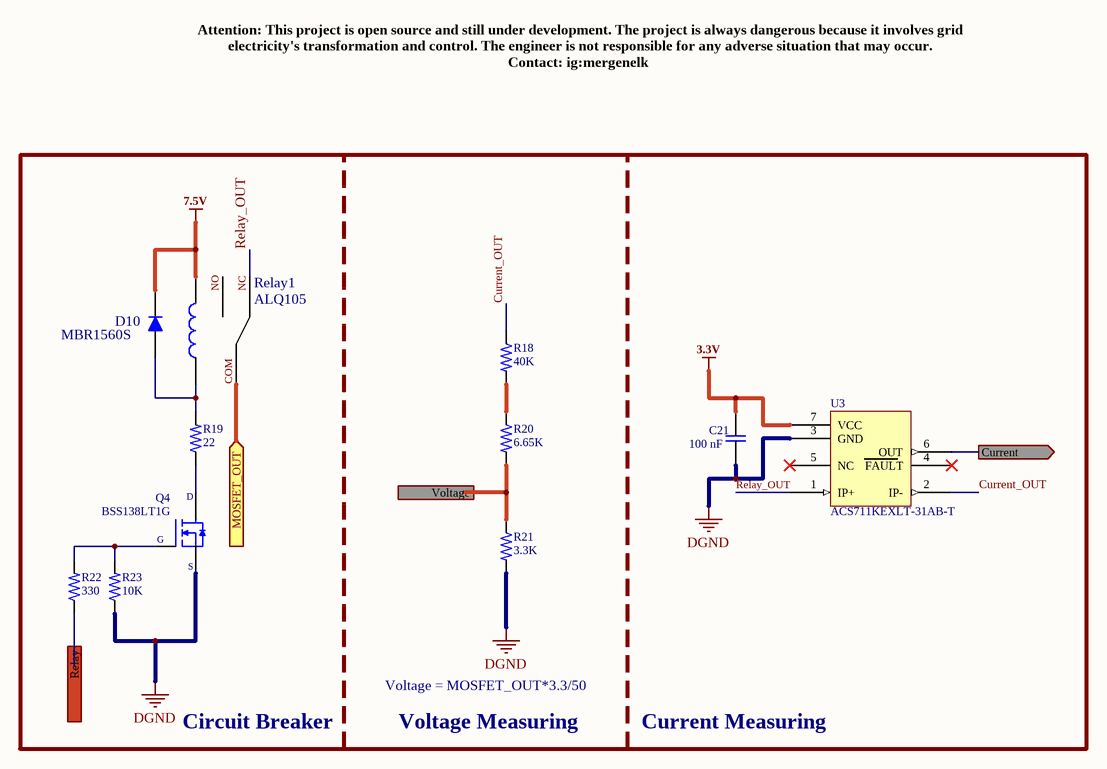
[diagram p4: Measuring.SchDoc]

### Parts
C21  100 nF  [MergenElektronik_Capacitors_Ceramics_SMDs_0603_S_NS]
D10  MBR1560S  [MergenElektronik_Diodes_SingleDiodes_TO-277B]
Q4  BSS138LT1G  [MergenElektronik_Transistors_Mosfets_SOT-23]
R18  40K  [MergenElektronik_Resistors_ChipResistors_0603_S_NS]
R19  22  [MergenElektronik_Resistors_ChipResistors_0603_S]
R20  6.65K  [MergenElektronik_Resistors_ChipResistors_0603_S_NS]
R21  3.3K  [MergenElektronik_Resistors_ChipResistors_0603_S_NS]
R22  330  [MergenElektronik_Resistors_ChipResistors_0603_S_NS]
R23  10K  [MergenElektronik_Resistors_ChipResistors_0603_S_NS]
Relay1  ALQ105  [MergenElektronik_Relays_PowerRelays_ALQ105]
U3  ACS711KEXLT-31AB-T  [MergenElektronik_Sensors_CurrentSensors_ACS711KEXLT-31AB-T]

### Ports
Current (out, see MicroController[3B]), MOSFET_OUT (in, see GateDriverandMosfets[3A], GateDriverandMosfets[3B], GateDriverandMosfets[3C]), Relay (in, see MicroController[3B]), Voltage (out, see MicroController[3B])

### Nets
3.3V: C21.1 U3.7(VCC)
7.5V: D10.2(KATOT) Relay1.C2
DGND: C21.2 Q4.2(Source) R21.2 R23.1 U3.3(GND)
Current_OUT: R18.1 U3.2(IP-)
Relay_OUT: Relay1.NC U3.1(IP+)
NetC10_1: R20.2 R21.1 ; port Voltage
NetC12_1: U3.6(OUT) ; port Current
NetC15_ANOT: Relay1.COM ; port MOSFET_OUT
NetD10_1: D10.1(ANOT) R19.2 Relay1.C1
NetQ4_1: Q4.1(Gate) R22.2 R23.2
NetQ4_3: Q4.3(Drain) R19.1
NetR18_2: R18.2 R20.1
NetR22_1: R22.1 ; port Relay

Not connected (* = marked no-connect by the designer): Relay1 NO; U3 4(FAULT)* 5(NC)*

### Notes on the sheet
- Attention: This project is open source and still under development. The project is always dangerous because it involves grid electricity's transformation and control. The engineer is not responsible for any adverse situation that may occur.
  Contact: ig:mergenelk
- Circuit Breaker
- Voltage = MOSFET_OUT*3.3/50
- Voltage Measuring
- Current Measuring
- Title:
- Size:
- Date:
- A4
- Number:
- Time:
- Revision:
- Sheet
- of
- Project
- Drawn By :
- (in symbol MergenElektronik_Transistors_Mosfets_BSS138LT1G) D; G; S

### Library data of the parts
C21 = MergenElektronik_Capacitors_Ceramic_SMDs_100nF_16V: as C4 on sheet PowerDistribution; Value: 100 nF; Temperature: -55°C up to +125°C; Digi-Key Number: 1276-1005-1-ND; Package: 0603(1608); Mouser Number: 187-CL10B104KO8NNNC; Mounting Type: Surface Mount; Farnell Number: 3013413; Supplier 1: Mouser; Supplier 2: Digi-Key; Supplier Part Number 1: 187-CL10B104KO8NNNC; Supplier Part Number 2: 1276-1005-6-ND; Özdisan Number: CL10B104KO8NNNC; Voltage Rated: 16V
D10 = MergenElektronik_Diodes_SingleDiodes_MBR1560S: Mergen Elektronik - Diodes - Single Diodes - MBR1560S; Manufacturer: SMC Diode Solutions; Voltage Rated: 60V; Current Rating: 15A; Digi-Key Number: 1655-MBR1560SCT-ND; Manufacturer Number: MBR1560S; Model: Single Diodes; Mounting Type: Surface Mount; Package: TO-277B; Temperature: -55°C up to +150°C; Supplier 1: Digi-Key; Supplier Part Number 1: 1655-MBR1560SCT-ND
Q4 = MergenElektronik_Transistors_Mosfets_BSS138LT1G: Mergen Elektronik - Transistors - Mosfets - BSS138LT1G; Manufacturer: onsemi; Voltage Rated: 50V; Model: Mosfet; Id: 200mA; Value: BSS138LT1G; Temperature: -55°C up to +175°C (TJ); Digi-Key Number: BSS138LT1GOSCT-ND; Manufacturer Number: BSS138LT1G; Package: SOT-23; Mounting Type: Surface Mount; Vdss: 50V; Rating Current: 200mA; Mouser Number: 863-BSS138LT1G; Farnell Number: 1431319; Supplier 1: Digi-Key; Supplier 2: Mouser; Supplier Part Number 1: BSS138LT1GOSCT-ND; Supplier Part Number 2: 863-BSS138LT1G; Özdisan Number: BSS138LT1G; Current Rating: 200mA
R18 = MergenElektronik_Resistors_ChipResistors_0603_40K: as R4 on sheet MicroController; Package: 0603(1608); Temperature: -55°C up to +155°C - X8R; Model: Chip Resistor; Digi-Key Number: 13-RT0603BRD0740KLTR-ND; Mounting Type: Surface Mount; Mouser Number: 603-RT0603BRD0740KL; Supplier 1: Digikey; Supplier 2: Mouser; Supplier Part Number 1: 13-RT0603BRD0740KLDKR-ND; Supplier Part Number 2: 603-RT0603BRD0740KL
R19 = MergenElektronik_Resistors_ChipResistors_0603_22: Mergen Elektronik - Resistors - Chip Resistors - 0603 - 22; Manufacturer: TE Connectivity; Manufacturer Number: CRGCQ0603J22R; Value: Chip Resistor - 0603 - 22; Power: 1/10W; Tolerance: ±5%; Özdisan Number: RMCF0603ZT0R00; Package: 0603(1608); Temperature: -55°C up to +155°C - X8R; Model: Chip Resistor; Digi-Key Number: A130081CT-ND; Mounting Type: Surface Mount; Mouser Number: 279-CRGCQ0603J22R; Farnell Number: 2861854; Supplier 1: Digi-Key; Supplier 2: Mouser; Supplier Part Number 1: A130081CT-ND; Supplier Part Number 2: 279-CRGCQ0603J22R
R20 = MergenElektronik_Resistors_ChipResistors_0603_6.65K: Mergen Elektronik - Resistors - Chip Resistors - 0603 - 6.65K; Manufacturer: YAGEO; Manufacturer Number: RC0603FR-076K65L; Value: Chip Resistor - 0603 - 6.65K; Power: 1/10W; Tolerance: ±1%; Package: 0603(1608); Temperature: -55°C up to +155°C - X8R; Model: Chip Resistor; Digi-Key Number: 311-6.65KHRCT-ND; Mounting Type: Surface Mount; Mouser Number: 603-RC0603FR-076K65L; Farnell Number: 3950957; Özdisan Number: RC0603FR-076K65L; Supplier 1: Digikey; Supplier 2: Mouser; Supplier Part Number 1: 311-6.65KHRCT-ND; Supplier Part Number 2: 603-RC0603FR-076K65L
R21 = MergenElektronik_Resistors_ChipResistors_0603_3.3K: Mergen Elektronik - Resistors - Chip Resistors - 0603 - 3.3K; Manufacturer: YAGEO; Manufacturer Number: RC0603FR-073K3L; Value: Chip Resistor - 0603 - 3.3K; Power: 1/10W; Tolerance: ±1%; Package: 0603(1608); Temperature: -55°C up to +155°C - X8R; Model: Chip Resistor; Digi-Key Number: 311-3.30KHRTR-ND; Mounting Type: Surface Mount; Mouser Number: 603-RC0603FR-073K3L; Farnell Number: 9238549; Özdisan Number: RC0603FR-073K3L; Supplier 1: Digikey; Supplier 2: Mouser; Supplier Part Number 1: 311-3.30KHRCT-ND; Supplier Part Number 2: RC0603FR-073K3L
R22 = MergenElektronik_Resistors_ChipResistors_0603_330R: as R3 on sheet PowerDistribution; Package: 0603(1608); Temperature: -55°C up to +155°C - X8R; Model: Chip Resistor; Digi-Key Number: RMCF0603JT330RCT-ND; Mounting Type: Surface Mount; Supplier 1: Digi-Key; Supplier Part Number 1: RMCF0603JT330RCT-ND
R23 = MergenElektronik_Resistors_ChipResistors_0603_10K: as R1 on sheet PowerDistribution; Package: 0603(1608); Temperature: -55°C up to +155°C - X8R; Model: Chip Resistor; Digi-Key Number: RMCF0603JT10K0CT-ND; Mounting Type: Surface Mount; Supplier 1: Digi-Key; Supplier Part Number 1: RMCF0603JT10K0-ND
Relay1 = MergenElektronik_Relays_PowerRelays_ALQ105: Mergen Elektronik - Relays - Power Relays - ALQ105; Manufacturer: Panasonic; Current Rating: 5A; Switching Voltage: 250VAC, 30VDC - Max; Digi-Key Number: 255-3565-ND; Manufacturer Number: ALQ105; Model: Power Relays; Mounting Type: THT; Value: ALQ105; Temperature: -40°C up to 85°C; Mouser Number: 769-ALQ105; Farnell Number: 2503675; Supplier 1: Digi-Key; Supplier Part Number 1: 255-3565-ND; Package: ALQ105; Supplier 2: Mouser; Supplier Part Number 2: 769-ALQ105
U3 = MergenElektronik_Sensors_CurrentSensors_ACS711KEXLT-31AB-T: Mergen Elektronik - Sensors - Current Sensors - ACS711KEXLT-31AB-T; Manufacturer: Allegro MicroSystems; Current Rating: 31A; Accuracy: ±5%; Operating Supply  Voltage: 3V up to 5.5V; Number of Channel: 1; Measuring: AC/DC; Sensor Type: Hall Effect; Digi-Key Number: 620-1482-1-ND; Manufacturer Number: ACS711KEXLT-31AB-T; Model: Current Sensor; Mounting Type: Surface Mount; Package: ACS711KEXLT-31AB-T; Mouser Number: 250-711KEXLT31ABT; Temperature: -40°C up to +125°C; Value: ACS711KEXLT-31AB-T; Özdisan Number: ACS711KEXLT-31AB-T; Farnell Number: 3594556; Supplier 1: Digi-Key; Supplier Part Number 1: 620-1482-1-ND; Supplier 2: Mouser; Supplier Part Number 2: 250-711KEXLT31ABT

## Sheet Control.SchDoc: Control
size A4; ApprovedBy: Ekrem Turan Fırat; CheckedBy: Ekrem Turan Fırat; Author: Ekrem Turan Fırat; CompanyName: Mergen Elektronik; DrawnBy: Ekrem T. Fırat; Engineer: Ekrem Turan Fırat; Organization: Mergen Elektronik; Address1: Türkiye; DocumentNumber: 20240101; Revision: v0.0.1; SheetNumber: 7; SheetTotal: 7
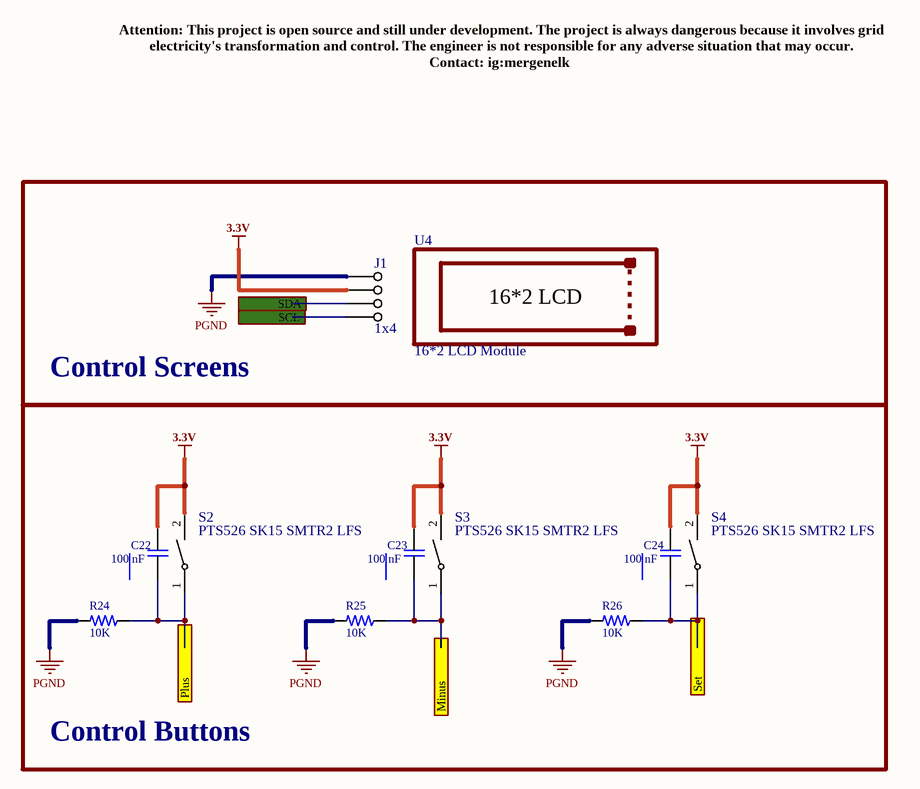
[diagram p5: Control.SchDoc]

### Parts
C22  100 nF  [MergenElektronik_Capacitors_Ceramics_SMDs_0603_S_NS]
C23  100 nF  [MergenElektronik_Capacitors_Ceramics_SMDs_0603_S_NS]
C24  100 nF  [MergenElektronik_Capacitors_Ceramics_SMDs_0603_S_NS]
J1  1x4  [MergenElektronik_Connectors_Headers_1x4_Male]
R24  10K  [MergenElektronik_Resistors_ChipResistors_0603_S_NS]
R25  10K  [MergenElektronik_Resistors_ChipResistors_0603_S_NS]
R26  10K  [MergenElektronik_Resistors_ChipResistors_0603_S_NS]
S2  PTS526 SK15 SMTR2 LFS  [MergenElektronik_Switches_TactileSwitches_PTS526]
S3  PTS526 SK15 SMTR2 LFS  [MergenElektronik_Switches_TactileSwitches_PTS526]
S4  PTS526 SK15 SMTR2 LFS  [MergenElektronik_Switches_TactileSwitches_PTS526]
U4  16*2 LCD Module  [MergenElektronik_Screens_LCDs_16x2Module]

### Blocks framed on the sheet
Control Screens: J1 U4
Control Buttons: C22-C24 R24-R26 S2-S4

### Ports
Minus (out, see MicroController[3B]), Plus (out, see MicroController[3B]), SCL (in, see MicroController[3B]), SDA (in, see MicroController[3B]), Set (out, see MicroController[3B])

### Nets
3.3V: C22.1 C23.1 C24.1 J1.3 S2.2 S3.2 S4.2
PGND: J1.4 R24.2 R25.2 R26.2
NetC22_2: C22.2 R24.1 S2.1 ; port Plus
NetC23_2: C23.2 R25.1 S3.1 ; port Minus
NetC24_2: C24.2 R26.1 S4.1 ; port Set
NetJ1_1: J1.1 ; port SCL
NetJ1_2: J1.2 ; port SDA

### Notes on the sheet
- Attention: This project is open source and still under development. The project is always dangerous because it involves grid electricity's transformation and control. The engineer is not responsible for any adverse situation that may occur.
  Contact: ig:mergenelk
- Title:
- Size:
- Date:
- A4
- Number:
- Time:
- Revision:
- Sheet
- of
- Project
- Drawn By :
- (in symbol MergenElektronik_Screens_LCDs_16x2Module) 16*2 LCD

### Library data of the parts
C22-C24 = MergenElektronik_Capacitors_Ceramic_SMDs_100nF_16V: as C4 on sheet PowerDistribution; Value: 100 nF; Temperature: -55°C up to +125°C; Digi-Key Number: 1276-1005-1-ND; Package: 0603(1608); Mouser Number: 187-CL10B104KO8NNNC; Mounting Type: Surface Mount; Farnell Number: 3013413; Supplier 1: Mouser; Supplier 2: Digi-Key; Supplier Part Number 1: 187-CL10B104KO8NNNC; Supplier Part Number 2: 1276-1005-6-ND; Özdisan Number: CL10B104KO8NNNC; Voltage Rated: 16V
J1 = MergenElektronik_Connectors_Headers_1x4_Male: Mergen Elektronik - Connectors - Headers - 1x4 Male
R24-R26 = MergenElektronik_Resistors_ChipResistors_0603_10K: as R1 on sheet PowerDistribution; Package: 0603(1608); Temperature: -55°C up to +155°C - X8R; Model: Chip Resistor; Digi-Key Number: RMCF0603JT10K0CT-ND; Mounting Type: Surface Mount; Supplier 1: Digi-Key; Supplier Part Number 1: RMCF0603JT10K0-ND
S2-S4 = MergenElektronik_Switches_TactileSwitches_PTS526 SK15 SMTR2 LFS: Mergen Elektronik - Switches - Tactile  Switches - PTS526 SK15 SMTR2 LFS; Manufacturer: C&K; Current Rating: 50mA; Voltage Rated: 12VDC; Manufacturer Number: PTS526 SK15 SMTR2 LFS; Digi-Key Number: CKN12221-2-ND; Model: Tactile Switches; Mounting Type: Surface Mount; Package: PTS526; Temperature: -20°C up to +70°C; Value: PTS526 SK15 SMTR2 LFS; Mouser Number: 611-PTS526SK15SMR2L; Farnell Number: 3780596; Supplier 1: Digi-Key; Supplier 2: Mouser; Supplier Part Number 1: CKN12221-2-ND; Supplier Part Number 2: 611-PTS526SK15SMR2L
U4 = MergenElektronik_Screens_LCDs_16x2Module: Mergen Elektronik - Screens - LCDs - 16x2 Module

## Nets that join several sheets
3.3V: PowerDistribution (PTC1.2 R3.1), MicroController (D5.1 D6.1 R4.1 U1.2), Measuring (C21.1 U3.7), Control (7 pins)
7.5V: PowerDistribution (6 pins), GateDriverandMosfets (C17.1 U2.1), Measuring (D10.2 Relay1.C2)
DGND: PowerDistribution (6 pins), MicroController (11 pins), GateDriverandMosfets (7 pins), Measuring (5 pins)
PGND: PowerDistribution (5 pins), GateDriverandMosfets (6 pins), Control (J1.4 R24.2 R25.2 R26.2)
VCC: PowerDistribution (6 pins), GateDriverandMosfets (Q1.3 Q2.3 Q3.3)
NetC10_1: MicroController (C10.1 U1.14), Measuring (R20.2 R21.1)
NetC11_1: MicroController (C11.1 U1.13), GateDriverandMosfets (U2.7)
NetC12_1: MicroController (C12.1 U1.15), Measuring (U3.6)
NetC15_ANOT: GateDriverandMosfets (6 pins), Measuring (Relay1.COM)
NetC18_1: MicroController (R5.2 U1.7), GateDriverandMosfets (C18.1 R11.1 U2.6)
NetC22_2: MicroController (U1.11), Control (C22.2 R24.1 S2.1)
NetC23_2: MicroController (U1.12), Control (C23.2 R25.1 S3.1)
NetC24_2: MicroController (U1.16), Control (C24.2 R26.1 S4.1)
NetJ1_1: MicroController (U1.18), Control (J1.1)
NetJ1_2: MicroController (U1.19), Control (J1.2)
NetR22_1: MicroController (U1.10), Measuring (R22.1)